# Altium schematic sheet backlight_W.SchDoc: Backlight W
size 594 x 420 mm; Author: T. Ludemann; SheetNumber: 4; SheetTotal: 4; DocSize: DINA2
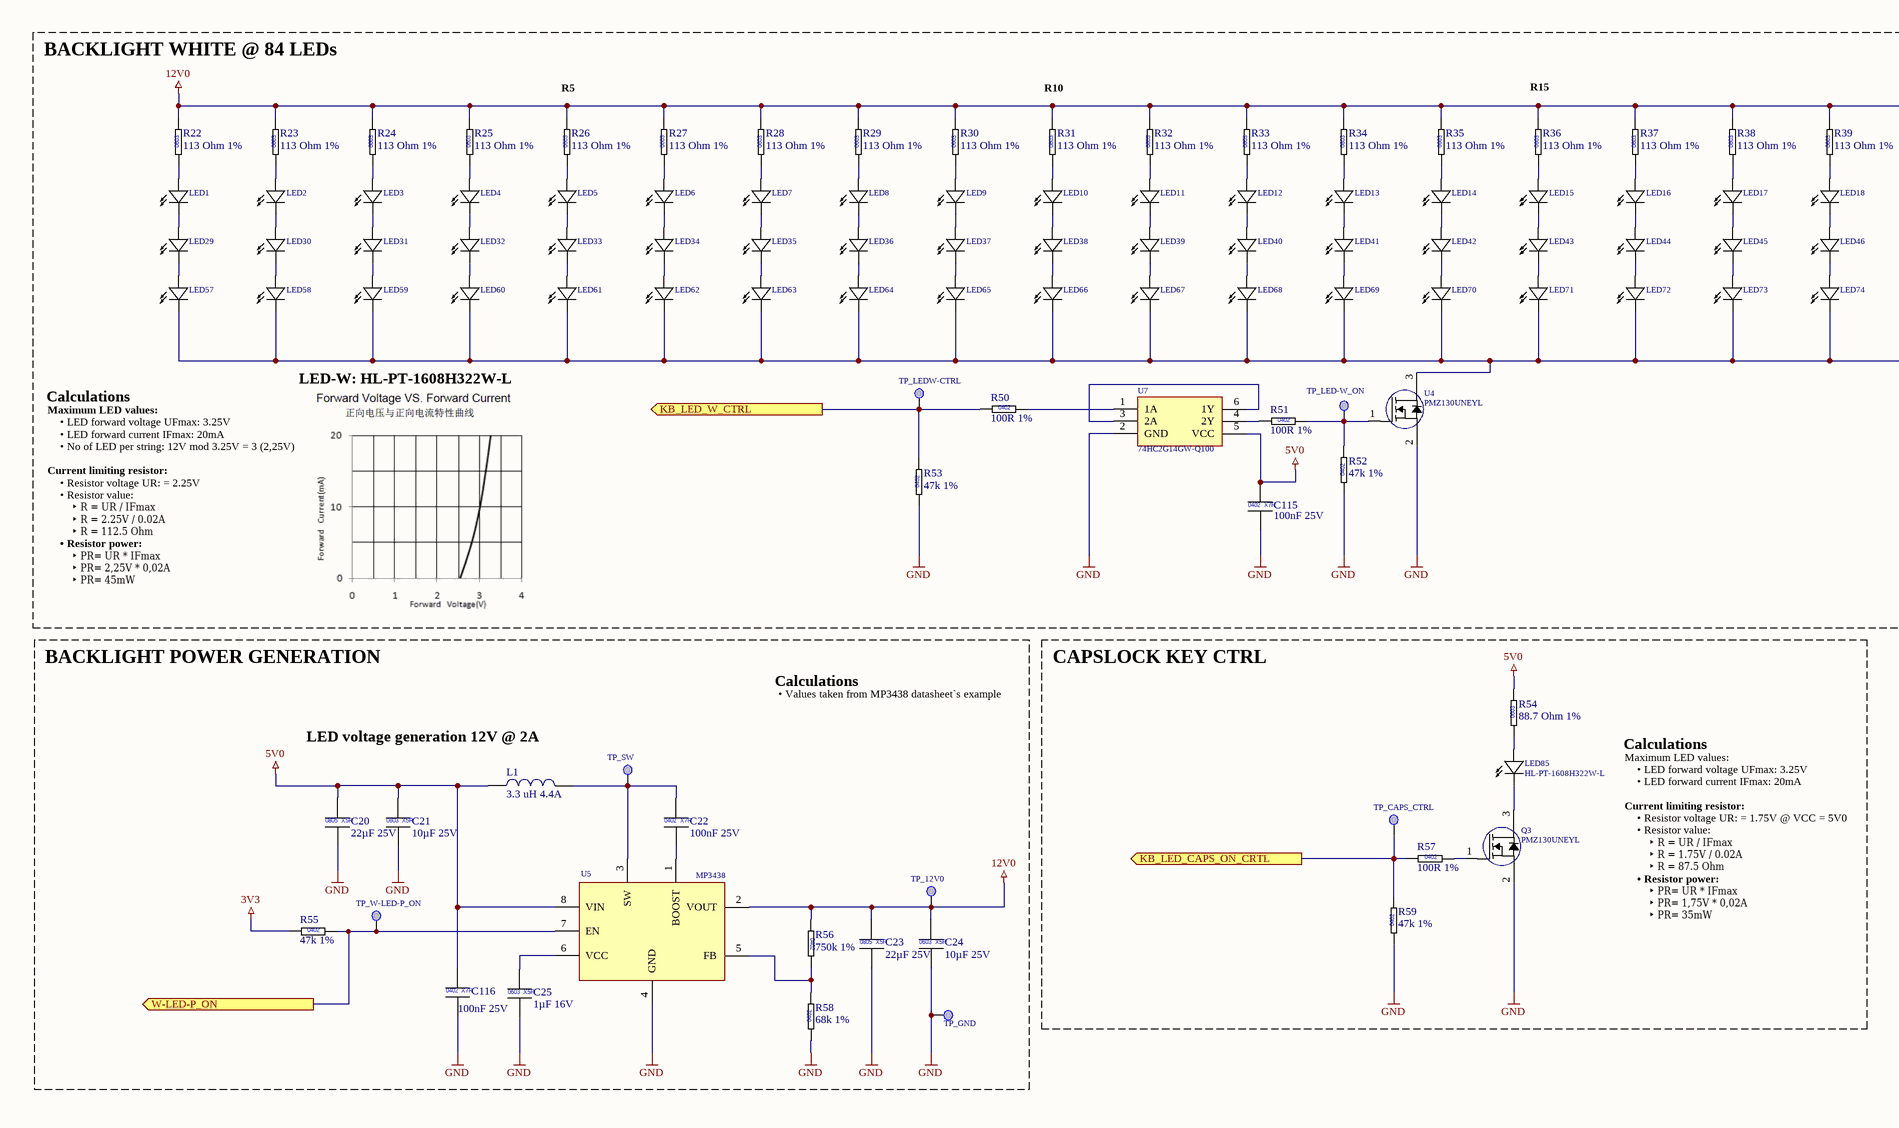
[diagram p0: backlight_W.SchDoc, left]
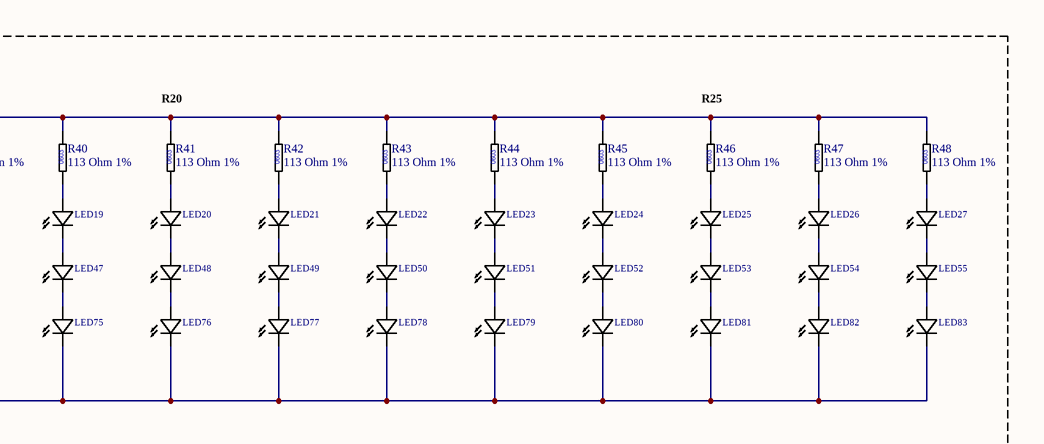
[diagram p1: backlight_W.SchDoc, right]

## Parts
?  (no value)  (graphical)
C20  22µF 25V  [CAPC2012X14L]
C21  10µF 25V  [CAPC1608X10L]
C22  100nF 25V  [CAPC1005X06L]
C23  22µF 25V  [CAPC2012X14L]
C24  10µF 25V  [CAPC1608X10L]
C25  1µF 16V  [CAPC1608X10L]
C115  100nF 25V  [CAPC1005X06L]
C116  100nF 25V  [CAPC1005X06L]
L1  3.3 uH 4.4A  [INDM4141X21N]
LED1  HL-PT-1608H322W-L  [LED 0603]  (value not drawn)
LED2  HL-PT-1608H322W-L  [LED 0603]  (value not drawn)
LED3  HL-PT-1608H322W-L  [LED 0603]  (value not drawn)
LED4  HL-PT-1608H322W-L  [LED 0603]  (value not drawn)
LED5  HL-PT-1608H322W-L  [LED 0603]  (value not drawn)
LED6  HL-PT-1608H322W-L  [LED 0603]  (value not drawn)
LED7  HL-PT-1608H322W-L  [LED 0603]  (value not drawn)
LED8  HL-PT-1608H322W-L  [LED 0603]  (value not drawn)
LED9  HL-PT-1608H322W-L  [LED 0603]  (value not drawn)
LED10  HL-PT-1608H322W-L  [LED 0603]  (value not drawn)
LED11  HL-PT-1608H322W-L  [LED 0603]  (value not drawn)
LED12  HL-PT-1608H322W-L  [LED 0603]  (value not drawn)
LED13  HL-PT-1608H322W-L  [LED 0603]  (value not drawn)
LED14  HL-PT-1608H322W-L  [LED 0603]  (value not drawn)
LED15  HL-PT-1608H322W-L  [LED 0603]  (value not drawn)
LED16  HL-PT-1608H322W-L  [LED 0603]  (value not drawn)
LED17  HL-PT-1608H322W-L  [LED 0603]  (value not drawn)
LED18  HL-PT-1608H322W-L  [LED 0603]  (value not drawn)
LED19  HL-PT-1608H322W-L  [LED 0603]  (value not drawn)
LED20  HL-PT-1608H322W-L  [LED 0603]  (value not drawn)
LED21  HL-PT-1608H322W-L  [LED 0603]  (value not drawn)
LED22  HL-PT-1608H322W-L  [LED 0603]  (value not drawn)
LED23  HL-PT-1608H322W-L  [LED 0603]  (value not drawn)
LED24  HL-PT-1608H322W-L  [LED 0603]  (value not drawn)
LED25  HL-PT-1608H322W-L  [LED 0603]  (value not drawn)
LED26  HL-PT-1608H322W-L  [LED 0603]  (value not drawn)
LED27  HL-PT-1608H322W-L  [LED 0603]  (value not drawn)
LED29  HL-PT-1608H322W-L  [LED 0603]  (value not drawn)
LED30  HL-PT-1608H322W-L  [LED 0603]  (value not drawn)
LED31  HL-PT-1608H322W-L  [LED 0603]  (value not drawn)
LED32  HL-PT-1608H322W-L  [LED 0603]  (value not drawn)
LED33  HL-PT-1608H322W-L  [LED 0603]  (value not drawn)
LED34  HL-PT-1608H322W-L  [LED 0603]  (value not drawn)
LED35  HL-PT-1608H322W-L  [LED 0603]  (value not drawn)
LED36  HL-PT-1608H322W-L  [LED 0603]  (value not drawn)
LED37  HL-PT-1608H322W-L  [LED 0603]  (value not drawn)
LED38  HL-PT-1608H322W-L  [LED 0603]  (value not drawn)
LED39  HL-PT-1608H322W-L  [LED 0603]  (value not drawn)
LED40  HL-PT-1608H322W-L  [LED 0603]  (value not drawn)
LED41  HL-PT-1608H322W-L  [LED 0603]  (value not drawn)
LED42  HL-PT-1608H322W-L  [LED 0603]  (value not drawn)
LED43  HL-PT-1608H322W-L  [LED 0603]  (value not drawn)
LED44  HL-PT-1608H322W-L  [LED 0603]  (value not drawn)
LED45  HL-PT-1608H322W-L  [LED 0603]  (value not drawn)
LED46  HL-PT-1608H322W-L  [LED 0603]  (value not drawn)
LED47  HL-PT-1608H322W-L  [LED 0603]  (value not drawn)
LED48  HL-PT-1608H322W-L  [LED 0603]  (value not drawn)
LED49  HL-PT-1608H322W-L  [LED 0603]  (value not drawn)
LED50  HL-PT-1608H322W-L  [LED 0603]  (value not drawn)
LED51  HL-PT-1608H322W-L  [LED 0603]  (value not drawn)
LED52  HL-PT-1608H322W-L  [LED 0603]  (value not drawn)
LED53  HL-PT-1608H322W-L  [LED 0603]  (value not drawn)
LED54  HL-PT-1608H322W-L  [LED 0603]  (value not drawn)
LED55  HL-PT-1608H322W-L  [LED 0603]  (value not drawn)
LED57  HL-PT-1608H322W-L  [LED 0603]  (value not drawn)
LED58  HL-PT-1608H322W-L  [LED 0603]  (value not drawn)
LED59  HL-PT-1608H322W-L  [LED 0603]  (value not drawn)
LED60  HL-PT-1608H322W-L  [LED 0603]  (value not drawn)
LED61  HL-PT-1608H322W-L  [LED 0603]  (value not drawn)
LED62  HL-PT-1608H322W-L  [LED 0603]  (value not drawn)
LED63  HL-PT-1608H322W-L  [LED 0603]  (value not drawn)
LED64  HL-PT-1608H322W-L  [LED 0603]  (value not drawn)
LED65  HL-PT-1608H322W-L  [LED 0603]  (value not drawn)
LED66  HL-PT-1608H322W-L  [LED 0603]  (value not drawn)
LED67  HL-PT-1608H322W-L  [LED 0603]  (value not drawn)
LED68  HL-PT-1608H322W-L  [LED 0603]  (value not drawn)
LED69  HL-PT-1608H322W-L  [LED 0603]  (value not drawn)
LED70  HL-PT-1608H322W-L  [LED 0603]  (value not drawn)
LED71  HL-PT-1608H322W-L  [LED 0603]  (value not drawn)
LED72  HL-PT-1608H322W-L  [LED 0603]  (value not drawn)
LED73  HL-PT-1608H322W-L  [LED 0603]  (value not drawn)
LED74  HL-PT-1608H322W-L  [LED 0603]  (value not drawn)
LED75  HL-PT-1608H322W-L  [LED 0603]  (value not drawn)
LED76  HL-PT-1608H322W-L  [LED 0603]  (value not drawn)
LED77  HL-PT-1608H322W-L  [LED 0603]  (value not drawn)
LED78  HL-PT-1608H322W-L  [LED 0603]  (value not drawn)
LED79  HL-PT-1608H322W-L  [LED 0603]  (value not drawn)
LED80  HL-PT-1608H322W-L  [LED 0603]  (value not drawn)
LED81  HL-PT-1608H322W-L  [LED 0603]  (value not drawn)
LED82  HL-PT-1608H322W-L  [LED 0603]  (value not drawn)
LED83  HL-PT-1608H322W-L  [LED 0603]  (value not drawn)
LED85  HL-PT-1608H322W-L  [LED 0603]
Q3  PMZ130UNEYL  [DFN65P98X50-3N]
R22  113 Ohm 1%  [RESC1608X04L]
R23  113 Ohm 1%  [RESC1608X04L]
R24  113 Ohm 1%  [RESC1608X04L]
R25  113 Ohm 1%  [RESC1608X04L]
R26  113 Ohm 1%  [RESC1608X04L]
R27  113 Ohm 1%  [RESC1608X04L]
R28  113 Ohm 1%  [RESC1608X04L]
R29  113 Ohm 1%  [RESC1608X04L]
R30  113 Ohm 1%  [RESC1608X04L]
R31  113 Ohm 1%  [RESC1608X04L]
R32  113 Ohm 1%  [RESC1608X04L]
R33  113 Ohm 1%  [RESC1608X04L]
R34  113 Ohm 1%  [RESC1608X04L]
R35  113 Ohm 1%  [RESC1608X04L]
R36  113 Ohm 1%  [RESC1608X04L]
R37  113 Ohm 1%  [RESC1608X04L]
R38  113 Ohm 1%  [RESC1608X04L]
R39  113 Ohm 1%  [RESC1608X04L]
R40  113 Ohm 1%  [RESC1608X04L]
R41  113 Ohm 1%  [RESC1608X04L]
R42  113 Ohm 1%  [RESC1608X04L]
R43  113 Ohm 1%  [RESC1608X04L]
R44  113 Ohm 1%  [RESC1608X04L]
R45  113 Ohm 1%  [RESC1608X04L]
R46  113 Ohm 1%  [RESC1608X04L]
R47  113 Ohm 1%  [RESC1608X04L]
R48  113 Ohm 1%  [RESC1608X04L]
R50  100R 1%  [RESC1005X04L]
R51  100R 1%  [RESC1005X04L]
R52  47k 1%  [RESC1005X04L]
R53  47k 1%  [RESC1005X04L]
R54  88.7 Ohm 1%  [RESC1608X04L]
R55  47k 1%  [RESC1005X04L]
R56  750k 1%  [RESC1005X04L]
R57  100R 1%  [RESC1005X04L]
R58  68k 1%  [RESC1005X04L]
R59  47k 1%  [RESC1005X04L]
TP_12V0  Testpoint 0.75mm  [TP_0.75mm]  (value not drawn)  (no BOM)
TP_CAPS_CTRL  Testpoint 0.75mm  [TP_0.75mm]  (value not drawn)  (no BOM)
TP_GND  Testpoint 0.75mm  [TP_0.75mm]  (value not drawn)  (no BOM)
TP_LED-W_ON  Testpoint 0.75mm  [TP_0.75mm]  (value not drawn)  (no BOM)
TP_LEDW-CTRL  Testpoint 0.75mm  [TP_0.75mm]  (value not drawn)  (no BOM)
TP_SW  Testpoint 0.75mm  [TP_0.75mm]  (value not drawn)  (no BOM)
TP_W-LED-P_ON  Testpoint 0.75mm  [TP_0.75mm]  (value not drawn)  (no BOM)
U4  PMZ130UNEYL  [DFN65P98X50-3N]
U5  MP3438  [SOT583]
U7  74HC2G14GW-Q100  [TSOP65P210X110-6N]

## Blocks framed on the sheet
BACKLIGHT WHITE @ 84 LEDs: C115 LED1-LED27 LED29-LED55 LED57-LED83 R22-R48 R50-R53 TP_LED-W_ON TP_LEDW-CTRL U4 U7
BACKLIGHT POWER GENERATION: C20-C25 C116 L1 R55 R56 R58 TP_12V0 TP_GND TP_SW TP_W-LED-P_ON U5
CAPSLOCK KEY CTRL: LED85 Q3 R54 R57 R59 TP_CAPS_CTRL

## Ports
KB_LED_CAPS_ON_CRTL (out), KB_LED_W_CTRL (out), W-LED-P_ON (out)

## Nets
3V3: R55.1
5V0: C20.1 C21.1 C115.1 C116.1 L1.1 R54.2 U5.8(VIN) U7.5(VCC)
12V0: C23.1 C24.1 R22.2 R23.2 R24.2 R25.2 R26.2 R27.2 R28.2 R29.2 R30.2 R31.2 R32.2 R33.2 R34.2 R35.2 R36.2 R37.2 R38.2 R39.2 R40.2 R41.2 R42.2 R43.2 R44.2 R45.2 R46.2 R47.2 R48.2 R56.1 TP_12V0.TP U5.2(VOUT)
GND: C20.2 C21.2 C23.2 C24.2 C25.2 C115.2 C116.2 Q3.2(S) R52.1 R53.1 R58.1 R59.1 TP_GND.TP U4.2(S) U5.4(GND) U7.2(GND)
KB_LED_CAPS_ON_CRTL: R57.1 R59.2 TP_CAPS_CTRL.TP ; port KB_LED_CAPS_ON_CRTL
KB_LED_W_CTRL: R50.1 R53.2 TP_LEDW-CTRL.TP ; port KB_LED_W_CTRL
W-LED-P_ON: R55.2 TP_W-LED-P_ON.TP U5.7(EN) ; port W-LED-P_ON
NetC22_1: C22.1 L1.2 TP_SW.TP U5.3(SW)
NetC22_2: C22.2 U5.1(BOOST)
NetC25_1: C25.1 U5.6(VCC)
NetLED1_1: LED1.1 LED29.2
NetLED1_2: LED1.2 R22.1
NetLED2_1: LED2.1 LED30.2
NetLED2_2: LED2.2 R23.1
NetLED3_1: LED3.1 LED31.2
NetLED3_2: LED3.2 R24.1
NetLED4_1: LED4.1 LED32.2
NetLED4_2: LED4.2 R25.1
NetLED5_1: LED5.1 LED33.2
NetLED5_2: LED5.2 R26.1
NetLED6_1: LED6.1 LED34.2
NetLED6_2: LED6.2 R27.1
NetLED7_1: LED7.1 LED35.2
NetLED7_2: LED7.2 R28.1
NetLED8_1: LED8.1 LED36.2
NetLED8_2: LED8.2 R29.1
NetLED9_1: LED9.1 LED37.2
NetLED9_2: LED9.2 R30.1
NetLED10_1: LED10.1 LED38.2
NetLED10_2: LED10.2 R31.1
NetLED11_1: LED11.1 LED39.2
NetLED11_2: LED11.2 R32.1
NetLED12_1: LED12.1 LED40.2
NetLED12_2: LED12.2 R33.1
NetLED13_1: LED13.1 LED41.2
NetLED13_2: LED13.2 R34.1
NetLED14_1: LED14.1 LED42.2
NetLED14_2: LED14.2 R35.1
NetLED15_1: LED15.1 LED43.2
NetLED15_2: LED15.2 R36.1
NetLED16_1: LED16.1 LED44.2
NetLED16_2: LED16.2 R37.1
NetLED17_1: LED17.1 LED45.2
NetLED17_2: LED17.2 R38.1
NetLED18_1: LED18.1 LED46.2
NetLED18_2: LED18.2 R39.1
NetLED19_1: LED19.1 LED47.2
NetLED19_2: LED19.2 R40.1
NetLED20_1: LED20.1 LED48.2
NetLED20_2: LED20.2 R41.1
NetLED21_1: LED21.1 LED49.2
NetLED21_2: LED21.2 R42.1
NetLED22_1: LED22.1 LED50.2
NetLED22_2: LED22.2 R43.1
NetLED23_1: LED23.1 LED51.2
NetLED23_2: LED23.2 R44.1
NetLED24_1: LED24.1 LED52.2
NetLED24_2: LED24.2 R45.1
NetLED25_1: LED25.1 LED53.2
NetLED25_2: LED25.2 R46.1
NetLED26_1: LED26.1 LED54.2
NetLED26_2: LED26.2 R47.1
NetLED27_1: LED27.1 LED55.2
NetLED27_2: LED27.2 R48.1
NetLED29_1: LED29.1 LED57.2
NetLED30_1: LED30.1 LED58.2
NetLED31_1: LED31.1 LED59.2
NetLED32_1: LED32.1 LED60.2
NetLED33_1: LED33.1 LED61.2
NetLED34_1: LED34.1 LED62.2
NetLED35_1: LED35.1 LED63.2
NetLED36_1: LED36.1 LED64.2
NetLED37_1: LED37.1 LED65.2
NetLED38_1: LED38.1 LED66.2
NetLED39_1: LED39.1 LED67.2
NetLED40_1: LED40.1 LED68.2
NetLED41_1: LED41.1 LED69.2
NetLED42_1: LED42.1 LED70.2
NetLED43_1: LED43.1 LED71.2
NetLED44_1: LED44.1 LED72.2
NetLED45_1: LED45.1 LED73.2
NetLED46_1: LED46.1 LED74.2
NetLED47_1: LED47.1 LED75.2
NetLED48_1: LED48.1 LED76.2
NetLED49_1: LED49.1 LED77.2
NetLED50_1: LED50.1 LED78.2
NetLED51_1: LED51.1 LED79.2
NetLED52_1: LED52.1 LED80.2
NetLED53_1: LED53.1 LED81.2
NetLED54_1: LED54.1 LED82.2
NetLED55_1: LED55.1 LED83.2
NetLED57_1: LED57.1 LED58.1 LED59.1 LED60.1 LED61.1 LED62.1 LED63.1 LED64.1 LED65.1 LED66.1 LED67.1 LED68.1 LED69.1 LED70.1 LED71.1 LED72.1 LED73.1 LED74.1 LED75.1 LED76.1 LED77.1 LED78.1 LED79.1 LED80.1 LED81.1 LED82.1 LED83.1 U4.3(D)
NetLED85_1: LED85.1 Q3.3(D)
NetLED85_2: LED85.2 R54.1
NetQ3_1: Q3.1(G) R57.2
NetR50_2: R50.2 U7.1(1A)
NetR51_1: R51.1 U7.4(2Y)
NetR51_2: R51.2 R52.2 TP_LED-W_ON.TP U4.1(G)
NetR56_2: R56.2 R58.2 U5.5(FB)
NetU7_3: U7.3(2A) U7.6(1Y)

## Notes on the sheet
- (near R26) R5
- (near R31) R10
- (near R36) R15
- (near R41) R20
- (near R46) R25
- Calculations
- Maximum LED values:
- LED-W: HL-PT-1608H322W-L
- Current limiting resistor:
- • LED forward voltage UFmax: 3.25V
- • No of LED per string: 12V mod 3.25V = 3 (2,25V)
- • LED forward current IFmax: 20mA
- • Resistor voltage UR: = 2.25V
- • Resistor value:
- ‣ R = UR / IFmax
- ‣ R = 2.25V / 0.02A
- ‣ R = 112.5 Ohm
- • Resistor power:
- ‣ PR= UR * IFmax
- ‣ PR= 2,25V * 0,02A
- ‣ PR= 45mW
- • Values taken from MP3438 datasheet`s example
- (near L1) LED voltage generation 12V @ 2A
- • Resistor voltage UR: = 1.75V @ VCC = 5V0
- ‣ R = 1.75V / 0.02A
- ‣ R = 87.5 Ohm
- ‣ PR= 1,75V * 0,02A
- ‣ PR= 35mW
- © OV Tech GmbH - Open Visions Technology
- (in symbol CAP_0402_100nF_25V) 0402; X7R
- (in symbol CAP_0603_1µ_16V) 0603; X5R
- (in symbol CAP_0603_10µ_25V) 0603; X5R
- (in symbol CAP_0805_22µ_25V) 0805; X5R
- (in symbol RES_0402_47k_1%) 0402
- (in symbol RES_0402_68k_1%) 0402
- (in symbol RES_0402_100R_1%) 0402
- (in symbol RES_0402_750k_1%) 0402
- (in symbol RES_0603_88R7_1%_1) 0603
- (in symbol RES_0603_113R_1%) 0603

## Library data of the parts
? = Titleblock_01
C20 C23 = CAP_0805_22µ_25V: Multilayer Ceramic Capacitors MLCC - SMD/SMT 0603 25VDC; Manufacturer 1: Murata Electronics; Manufacturer 1 Prt. Nr.: GRM21BR61E226ME44K; Manufacturer 2 Prt. Nr.: CC0805MKX5R8BB226; Manufacturer 2: YAGEO
C21 C24 = CAP_0603_10µ_25V: Multilayer Ceramic Capacitors MLCC - SMD/SMT 0603 25VDC; Manufacturer 1: Murata Electronics; Manufacturer 1 Prt. Nr.: GRM188R61E106KA73J; Manufacturer 2 Prt. Nr.: CL10A106MA8NRNC; Manufacturer 2: Samsung Electro-Mechanics
C22 C115 C116 = CAP_0402_100nF_25V: Multilayer Ceramic Capacitors MLCC - SMD/SMT 0402 25VDC; Manufacturer 1: KYOCERA AVX; Manufacturer 1 Prt. Nr.: KGM05AR71C104KH; Manufacturer 2 Prt. Nr.: EMK105B7104KV-F; Manufacturer 2: Taiyo Yuden
C25 = CAP_0603_1µ_16V: Multilayer Ceramic Capacitors MLCC - SMD/SMT 0603 16VDC; Manufacturer 1: Samsung Electro-Mechanics; Manufacturer 1 Prt. Nr.: CL05A105KO5NNNC; Manufacturer 2 Prt. Nr.: EMK105BJ105KV-F; Manufacturer 2: Taiyo Yuden
L1 = IND_MPL-AL4020-3R3_3.3uH_4.4A: Low-Resistance Molded Inductor 3.3μH; Manufacturer 1: MPS; Manufacturer 1 Prt. Nr.: MPL-AL4020-3R3
LED1-LED27 LED29-LED55 LED57-LED83 LED85 = LED White_HL-PT-1608H322W-L: 8000K~12000K 500mcd Yellow Diffused -40℃~+85℃ Positive post White light 130° 70mW 0603 Light Emitting Diodes (LED) ROHS; Manufacturer 1: HONGLITRONIC; Manufacturer 1 Prt. Nr.: HL-PT-1608H322W-L
Q3 U4 = N-Channel MOSFET_PMZ130UNEYL: MOSFET PMZ130UNE/SOT883/XQFN3; Manufacturer 1: Nexperia; Manufacturer 1 Prt. Nr.: PMZ130UNEYL
R22-R48 = RES_0603_113R_1%: Thick Film Resistors - SMD 113OHM 1%; Manufacturer 1: YAGEO; Manufacturer 1 Prt. Nr.: RC0603FR-07113RL; Manufacturer 2 Prt. Nr.: ERJ-3EKF1130V; Manufacturer 2: Panasonic Electronic Components
R50 R51 R57 = RES_0402_100R_1%: Thick Film Resistors - SMD 100R 1%; Manufacturer 1: Vishay / Dale; Manufacturer 1 Prt. Nr.: CRCW0402100RFKEDC; Manufacturer 2 Prt. Nr.: RC0402FR-07100RL; Manufacturer 2: YAGEO
R52 R53 R55 R59 = RES_0402_47k_1%: Thick Film Resistors - SMD 47k 1%; Manufacturer 1: Vishay / Dale; Manufacturer 1 Prt. Nr.: CRCW040247K0FKEDC; Manufacturer 2 Prt. Nr.: RT0402FRE0747KL; Manufacturer 2: YAGEO
R54 = RES_0603_88R7_1%_1: Thick Film Resistors - SMD 88.7OHM 1%; Manufacturer 1: Panasonic; Manufacturer 1 Prt. Nr.: ERJ-3EKF88R7V; Manufacturer 2 Prt. Nr.: CR0603-FX-88R7ELF; Manufacturer 2: Bourns
R56 = RES_0402_750k_1%: Thick Film Resistors - SMD 750k 1%; Manufacturer 1: Bourns; Manufacturer 1 Prt. Nr.: CR0402-FX-7503GLF; Manufacturer 2 Prt. Nr.: CRCW0402750KFKEDC; Manufacturer 2: Vishay / Dale
R58 = RES_0402_68k_1%: Thick Film Resistors - SMD 68k 1%; Manufacturer 1: Bourns; Manufacturer 1 Prt. Nr.: CR0402-FX-6802GLF; Manufacturer 2 Prt. Nr.: SFR01MZPJ683; Manufacturer 2: ROHM Semiconductor
U5 = Boost 2A, 16V_MP3438: 2A, 16V, High-Efficiency, Fully Integrated, Synchronous Boost Converter; Manufacturer 1: MPS; Manufacturer 1 Prt. Nr.: MP3438
U7 = Dual inverting Schmitt trigger 74HC2G14GW-Q100: Schmitt Trigger Inverter, 1I/P, 125Deg C Rohs Compliant: Yes |Nexperia 74HC2G14GW-Q100; Manufacturer 1: Nexperia; Manufacturer 1 Prt. Nr.: 74HC2G14GW-Q100